# Altium project 红外接收.PrjPCB
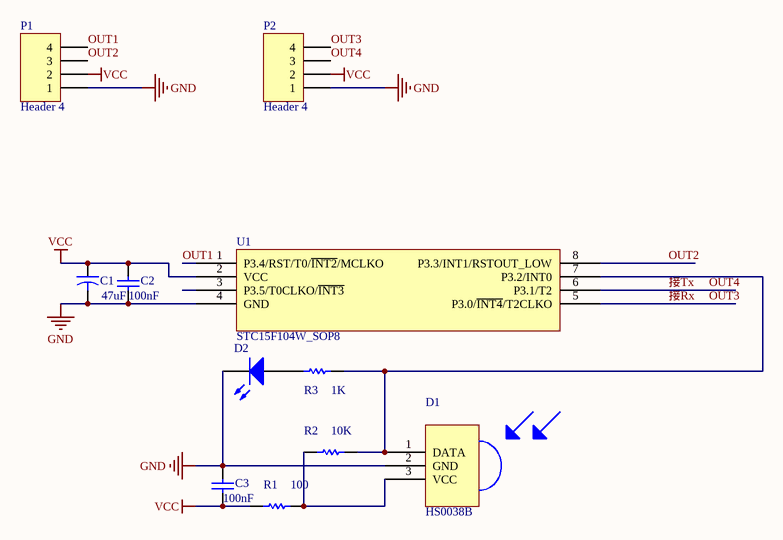
[diagram p0: 红外接收电路.SchDoc]
1 sheet, 11 parts. Net scope: global (net labels, ports and power ports of the same name join across sheets).
Board file: 红外接收电路.PcbDoc

## Sheet 红外接收电路.SchDoc
size A4

### Parts
C1  value 47uF  [C1210_N]  (hidden comment: Cap2)
C2  value 100nF  [6-0805_N]  (hidden comment: Cap)
C3  value 100nF  [6-0805_N]  (hidden comment: Cap)
D1  HS0038B  [E3]
D2  LED1  [6-0805_N]  (value not drawn)
P1  Header 4  [HDR1X4]
P2  Header 4  [HDR1X4]
R1  value 100  [6-0805_N]  (hidden comment: Res1)
R2  value 10K  [6-0805_N]  (hidden comment: Res1)
R3  value 1K  [6-0805_N]  (hidden comment: Res1)
U1  STC15F104W_SOP8  [DFN8]

### Nets
GND: C1.2 C2.1 C3.2 D1.2(GND) D2.2(K) P1.1 P2.1 U1.4(GND)
VCC: C1.1 C2.2 C3.1 P1.2 P2.2 R1.1 U1.2(VCC)
OUT1: P1.4 U1.1(P3.4/RST/T0/~{INT2}/MCLKO)
OUT2: P1.3 U1.8(P3.3/INT1/RSTOUT_LOW)
OUT3: P2.4 U1.5(P3.0/~{INT4}/T2CLKO)  [also labelled 接Rx]
OUT4: P2.3 U1.6(P3.1/T2)  [also labelled 接Tx]
NetD1_1: D1.1(DATA) R2.2 R3.2 U1.7(P3.2/INT0)
NetD1_3: D1.3(VCC) R1.2 R2.1
NetD2_1: D2.1(A) R3.1

Not connected (* = marked no-connect by the designer): U1 3(P3.5/T0CLKO/~{INT3})

### Library data of the parts
C1 = Cap2: Capacitor; Published: 23-Sep-2002; PackageReference: CAPR5-4X5; Publisher: Altium Limited; PackageDescription: Capacitor; 2 Leads
C2 C3 = Cap: Capacitor; Published: 8-Jun-2000; LatestRevisionDate: 17-Jul-2002; LatestRevisionNote: Re-released for DXP Platform.; PackageReference: RAD-0.3; Publisher: Altium Limited; PackageDescription: Radial Cap, Thru-Hole; 2 Leads; 0.3 in Pin Spacing
D2 = LED1: Typical RED GaAs LED; Published: 8-Jun-2000; LatestRevisionDate: 08-Jul-2005; LatestRevisionNote: Mech Layer 1 removed.; PackageReference: LED-1; Publisher: Altium Limited; PackageDescription: LED; 2 Leads
P1 P2 = Header 4: Header, 4-Pin; LatestRevisionDate: 17-Jul-2002; LatestRevisionNote: Re-released for DXP Platform.; Publisher: Altium Limited
R1-R3 = Res1: Resistor; Published: 8-Jun-2000; LatestRevisionDate: 17-Jul-2002; LatestRevisionNote: Re-released for DXP Platform.; PackageReference: AXIAL-0.3; Publisher: Altium Limited; PackageDescription: Axial Device, Thru-Hole; 2 Leads; 0.3 in Pin Spacing
U1 = STC15F101W_SOP8_DIP8